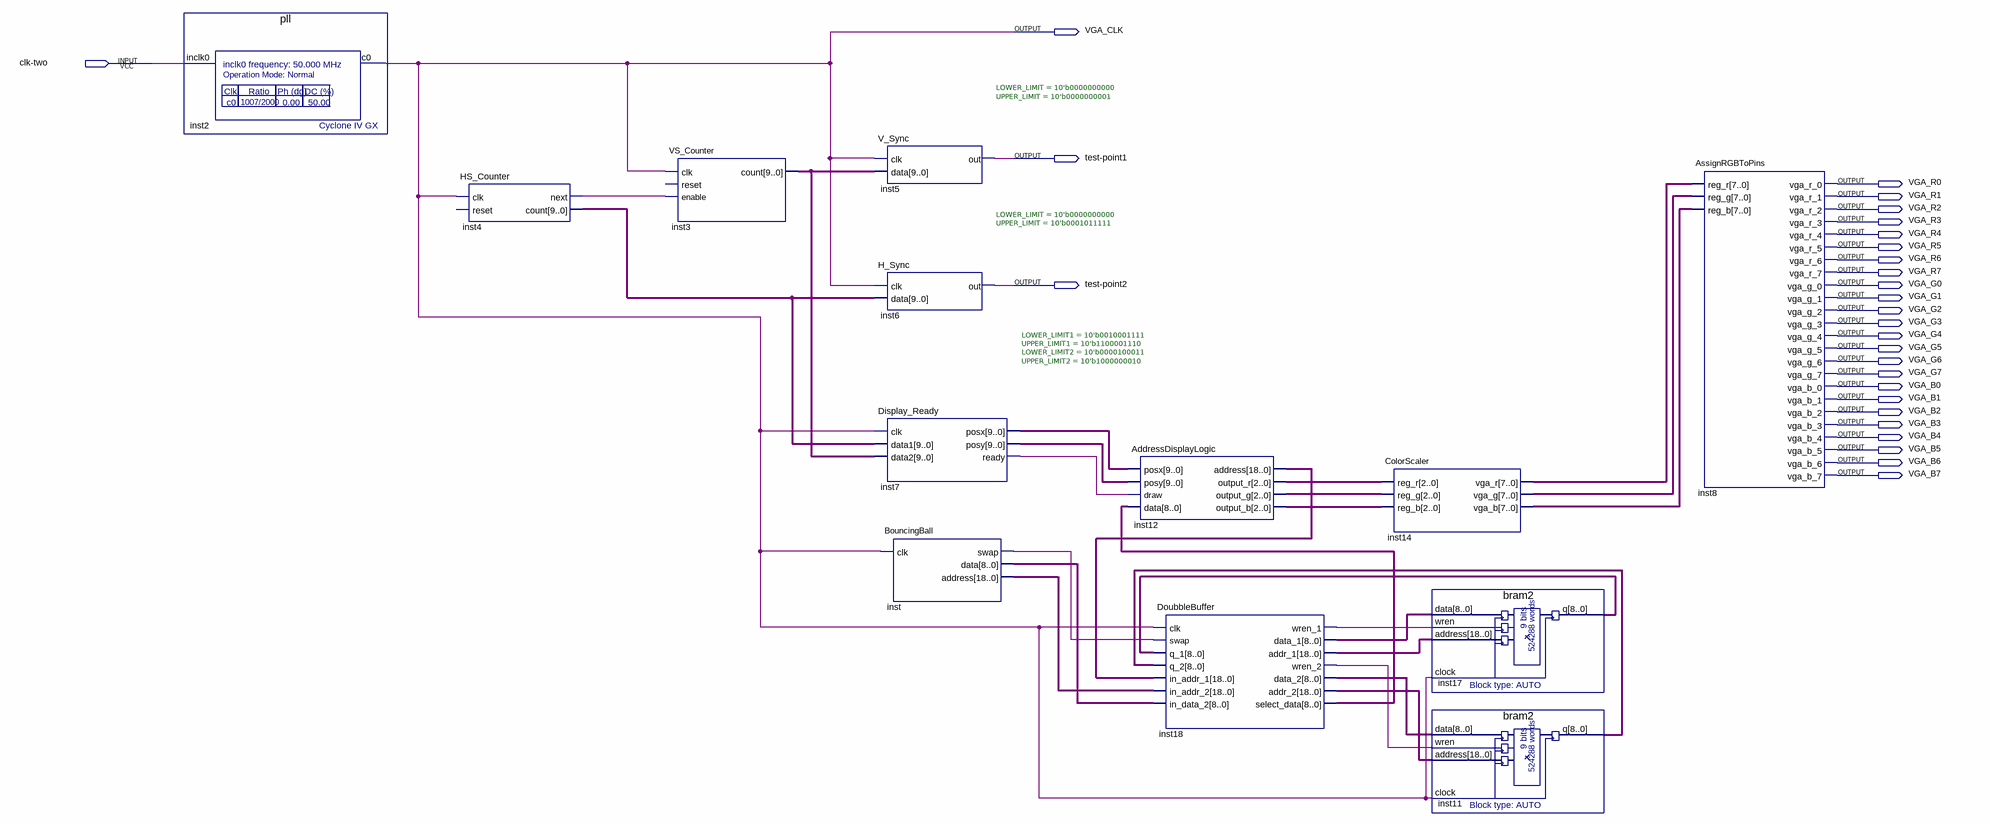
[diagram p0: schematic sheet]
// Quartus schematic getting-started.bdf as structural Verilog: 13 symbols, 28 pins
module \getting-started  (
  input  \clk-two ,
  output VGA_CLK,
  output \test-point1 ,
  output VGA_R0,
  output VGA_R1,
  output VGA_R2,
  output VGA_R3,
  output VGA_R4,
  output VGA_R5,
  output VGA_R6,
  output VGA_R7,
  output \test-point2 ,
  output VGA_G0,
  output VGA_G1,
  output VGA_G2,
  output VGA_G3,
  output VGA_G4,
  output VGA_G5,
  output VGA_G6,
  output VGA_G7,
  output VGA_B0,
  output VGA_B1,
  output VGA_B2,
  output VGA_B3,
  output VGA_B4,
  output VGA_B5,
  output VGA_B6,
  output VGA_B7
);

  wire inst4_next, inst7_ready, inst18_wren_1, inst18_wren_2, inst_swap;
  wire [2:0] inst12_output_b, inst12_output_g, inst12_output_r;
  wire [7:0] inst14_vga_b, inst14_vga_g, inst14_vga_r;
  wire [8:0] inst11_q, inst17_q, inst18_data_1, inst18_data_2, inst18_select_data, inst_data;
  wire [9:0] inst3_count, inst4_count, inst7_posx, inst7_posy;
  wire [18:0] inst12_address, inst18_addr_1, inst18_addr_2, inst_address;

  pll inst2 (.inclk0(\clk-two ), .c0(VGA_CLK));
  HS_Counter inst4 (.clk(VGA_CLK), .next(inst4_next), .count(inst4_count));  // open: reset
  VS_Counter inst3 (.clk(VGA_CLK), .enable(inst4_next), .count(inst3_count));  // open: reset
  V_Sync #(.LOWER_LIMIT(10'b0000000000), .UPPER_LIMIT(10'b0000000001)) inst5 (
    .clk(VGA_CLK), .data(inst3_count), .out(\test-point1 ));
  H_Sync #(.LOWER_LIMIT(10'b0000000000), .UPPER_LIMIT(10'b0001011111)) inst6 (
    .clk(VGA_CLK), .data(inst4_count), .out(\test-point2 ));
  Display_Ready #(.LOWER_LIMIT1(10'b0010001111), .UPPER_LIMIT1(10'b1100001110), .LOWER_LIMIT2(10'b0000100011), .UPPER_LIMIT2(10'b1000000010)) inst7 (
    .clk(VGA_CLK), .data1(inst4_count), .data2(inst3_count), .posx(inst7_posx), .posy(inst7_posy),
    .ready(inst7_ready));
  BouncingBall inst (.clk(VGA_CLK), .swap(inst_swap), .data(inst_data), .address(inst_address));
  AddressDisplayLogic inst12 (
    .posx(inst7_posx), .posy(inst7_posy), .draw(inst7_ready), .data(inst18_select_data),
    .address(inst12_address), .output_r(inst12_output_r), .output_g(inst12_output_g),
    .output_b(inst12_output_b));
  DoubbleBuffer inst18 (
    .clk(VGA_CLK), .swap(inst_swap), .q_1(inst17_q), .q_2(inst11_q), .in_addr_1(inst12_address),
    .in_addr_2(inst_address), .in_data_2(inst_data), .wren_1(inst18_wren_1), .data_1(inst18_data_1),
    .addr_1(inst18_addr_1), .wren_2(inst18_wren_2), .data_2(inst18_data_2), .addr_2(inst18_addr_2),
    .select_data(inst18_select_data));
  ColorScaler inst14 (
    .reg_r(inst12_output_r), .reg_g(inst12_output_g), .reg_b(inst12_output_b), .vga_r(inst14_vga_r),
    .vga_g(inst14_vga_g), .vga_b(inst14_vga_b));
  bram2 inst17 (.data(inst18_data_1), .wren(inst18_wren_1), .address(inst18_addr_1), .clock(VGA_CLK), .q(inst17_q));
  bram2 inst11 (.data(inst18_data_2), .wren(inst18_wren_2), .address(inst18_addr_2), .clock(VGA_CLK), .q(inst11_q));
  AssignRGBToPins inst8 (
    .reg_r(inst14_vga_r), .reg_g(inst14_vga_g), .reg_b(inst14_vga_b), .vga_r_0(VGA_R0), .vga_r_1(VGA_R1),
    .vga_r_2(VGA_R2), .vga_r_3(VGA_R3), .vga_r_4(VGA_R4), .vga_r_5(VGA_R5), .vga_r_6(VGA_R6),
    .vga_r_7(VGA_R7), .vga_g_0(VGA_G0), .vga_g_1(VGA_G1), .vga_g_2(VGA_G2), .vga_g_3(VGA_G3),
    .vga_g_4(VGA_G4), .vga_g_5(VGA_G5), .vga_g_6(VGA_G6), .vga_g_7(VGA_G7), .vga_b_0(VGA_B0),
    .vga_b_1(VGA_B1), .vga_b_2(VGA_B2), .vga_b_3(VGA_B3), .vga_b_4(VGA_B4), .vga_b_5(VGA_B5),
    .vga_b_6(VGA_B6), .vga_b_7(VGA_B7));
endmodule
